# EAGLE schematic pic16f877 general shematic (EAGLE 7.2.0)
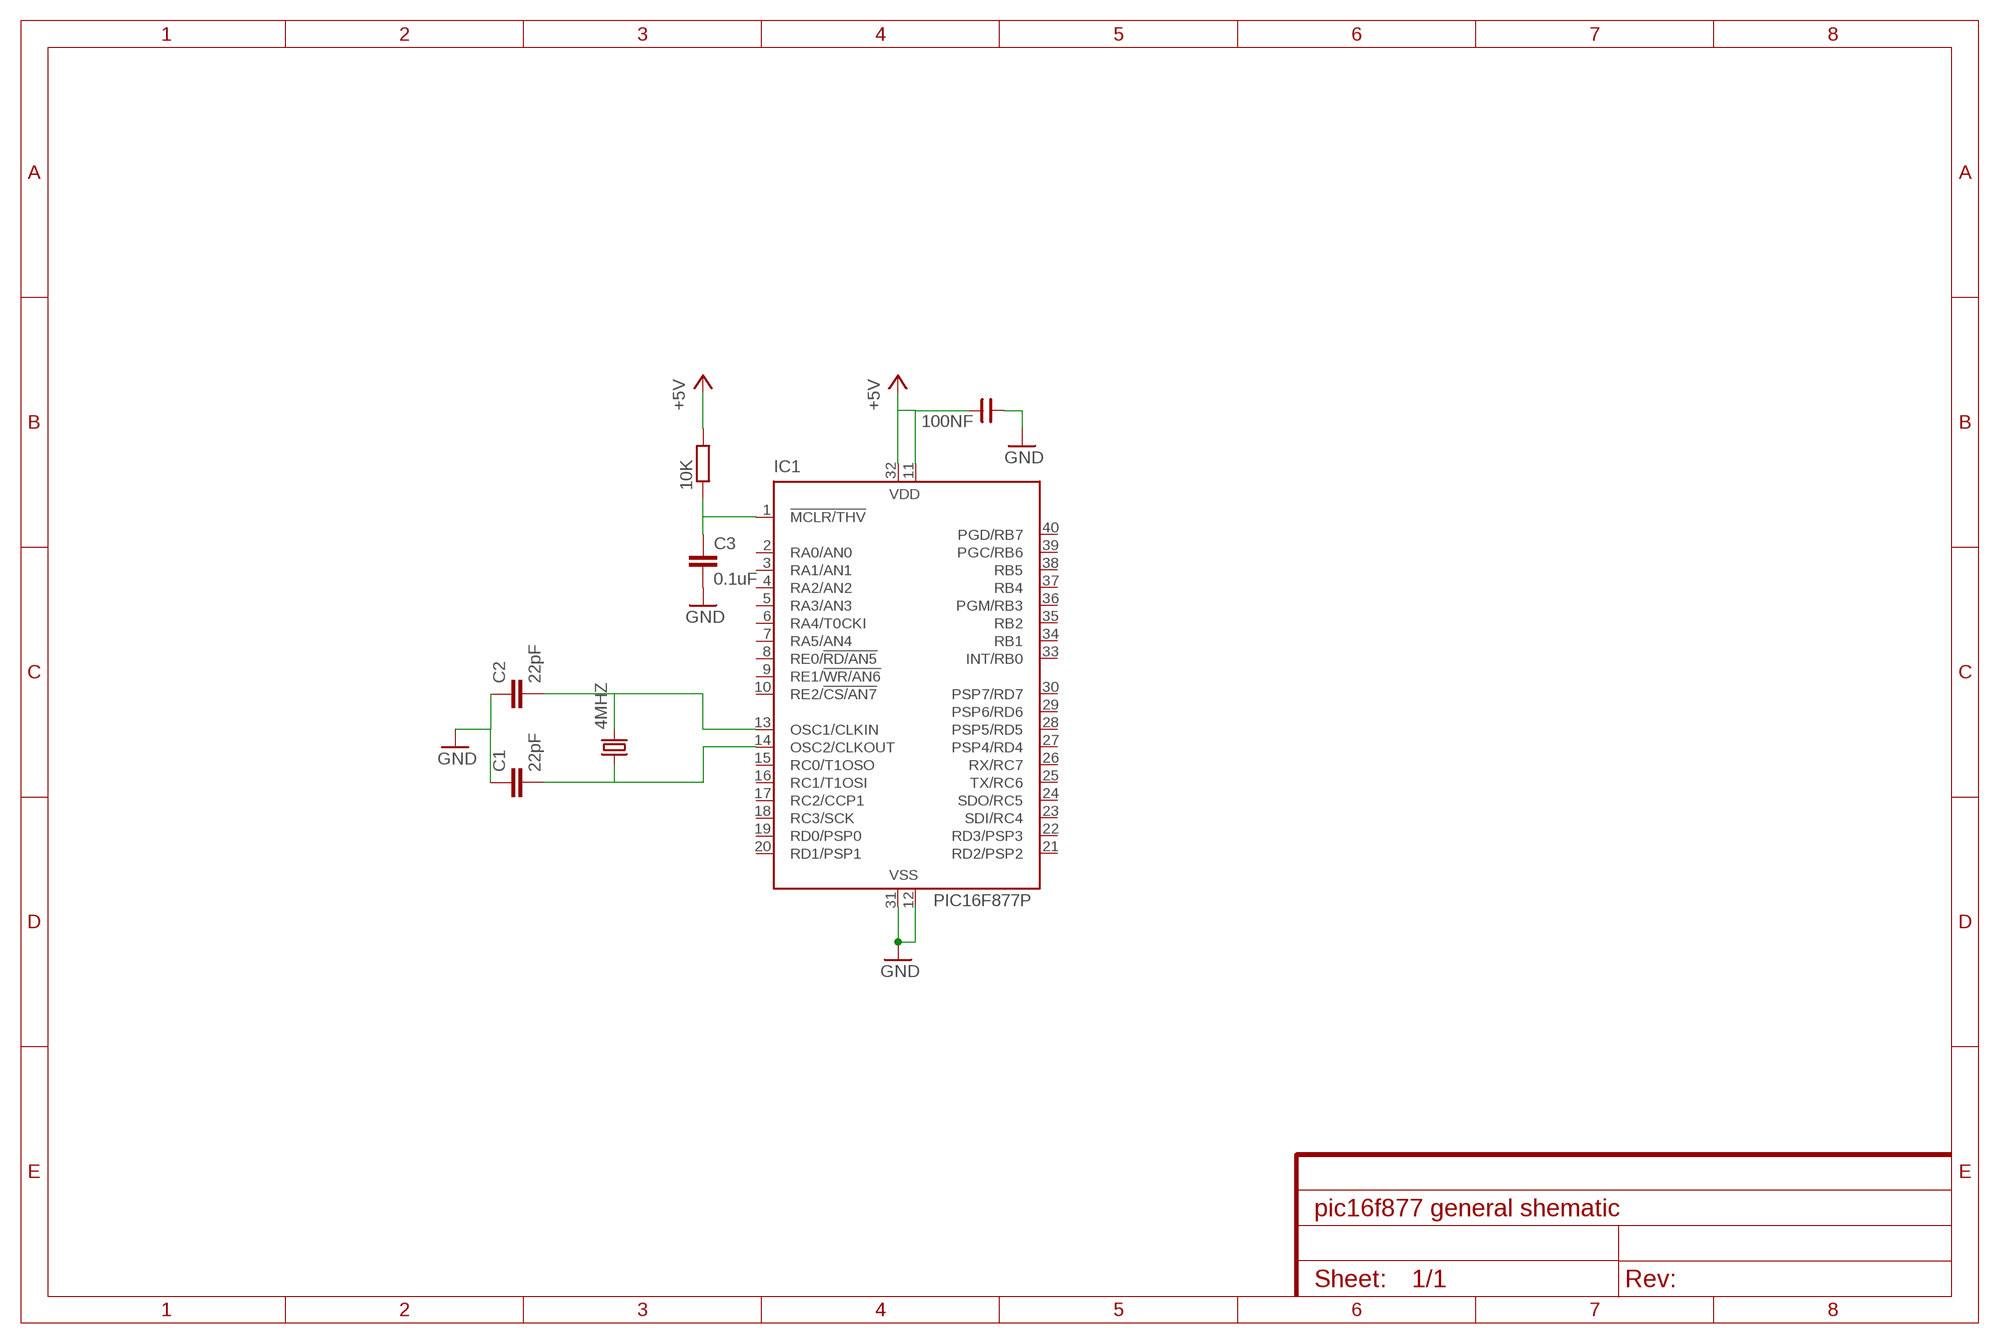
[diagram p0: schematic, sheet 1]

## Parts
4MHZ  CRYSTALHC49U-V  [HC49U-V]
10K  R0204/7  [0204/7]
100NF  CNP-0402  [0402]
C1  22pF  22PF-0603-50V-5%  [0603]
C2  22pF  22PF-0603-50V-5%  [0603]
C3  0.1uF  .1UF-CER  [0402-CAP]
IC1  PIC16F877P  [DIL40]

## Nets
+5V: 10K.2 100NF.2 IC1.11(VDD) IC1.32(VDD)
GND: 100NF.1 C1.1 C2.1 C3.2 IC1.12(VSS) IC1.31(VSS)
N$1: 4MHZ.1 C1.2 IC1.14(OSC2/CLKOUT)
N$2: 4MHZ.2 C2.2 IC1.13(OSC1/CLKIN)
N$3: 10K.1 C3.1 IC1.1(!MCLR/THV)
Unconnected: IC1.2(RA0/AN0) IC1.3(RA1/AN1) IC1.4(RA2/AN2) IC1.5(RA3/AN3) IC1.6(RA4/T0CKI) IC1.7(RA5/AN4) IC1.8(RE0/!RD/AN5) IC1.9(RE1/!WR/AN6) IC1.10(RE2/!CS/AN7) IC1.15(RC0/T1OSO) IC1.16(RC1/T1OSI) IC1.17(RC2/CCP1) IC1.18(RC3/SCK) IC1.19(RD0/PSP0) IC1.20(RD1/PSP1) IC1.21(RD2/PSP2) IC1.22(RD3/PSP3) IC1.23(SDI/RC4) IC1.24(SDO/RC5) IC1.25(TX/RC6) IC1.26(RX/RC7) IC1.27(PSP4/RD4) IC1.28(PSP5/RD5) IC1.29(PSP6/RD6) IC1.30(PSP7/RD7) IC1.33(INT/RB0) IC1.34(RB1) IC1.35(RB2) IC1.36(PGM/RB3) IC1.37(RB4) IC1.38(RB5) IC1.39(PGC/RB6) IC1.40(PGD/RB7)

## Library data of the parts
4MHZ = crystal:CRYSTAL: CRYSTAL; OC_FARNELL: 1666969; OC_NEWARK: unknown
10K = eagle-ltspice:R: RESISTOR, European symbol; SPICEMODEL: NONE; SPICEPREFIX: R
100NF = cap-master:CNP-: NON-POLARIZED CAP
C1 C2 = SparkFun-Capacitors:22PF: 22pF ceramic capacitors A capacitor is a passive two-terminal electrical component used to store electrical energy temporarily in an electric field.; PROD_ID: CAP-07876
C3 = SparkFun-Retired:.1UF-CER: .1uF ceramic SMT CAP-00810- 25V +80%/-20% (0603) CAP-08390- 100V 10% (0603) CAP-08604- 25V 5% (0603); PROD_ID: CAP-00810
IC1 = microchip:PIC16F87*: MICROCONTROLLER; MF: MICROCHIP; MPN: PIC16F877-04/P; OC_FARNELL: 9761349; OC_NEWARK: 61K3463